# Altium schematic sheet carte_balise_v100.SchDoc: TITLE:
size 410 x 286 mm; Date: Date:; >LAST_DATE_TIME: 11/4/2015 11:37:43 AM; Sheet:: Sheet:; >SHEET: 1; REV:: REV:; Document Number:: Document Number:; >DRAWING_NAME: carte_balise_v100.sch
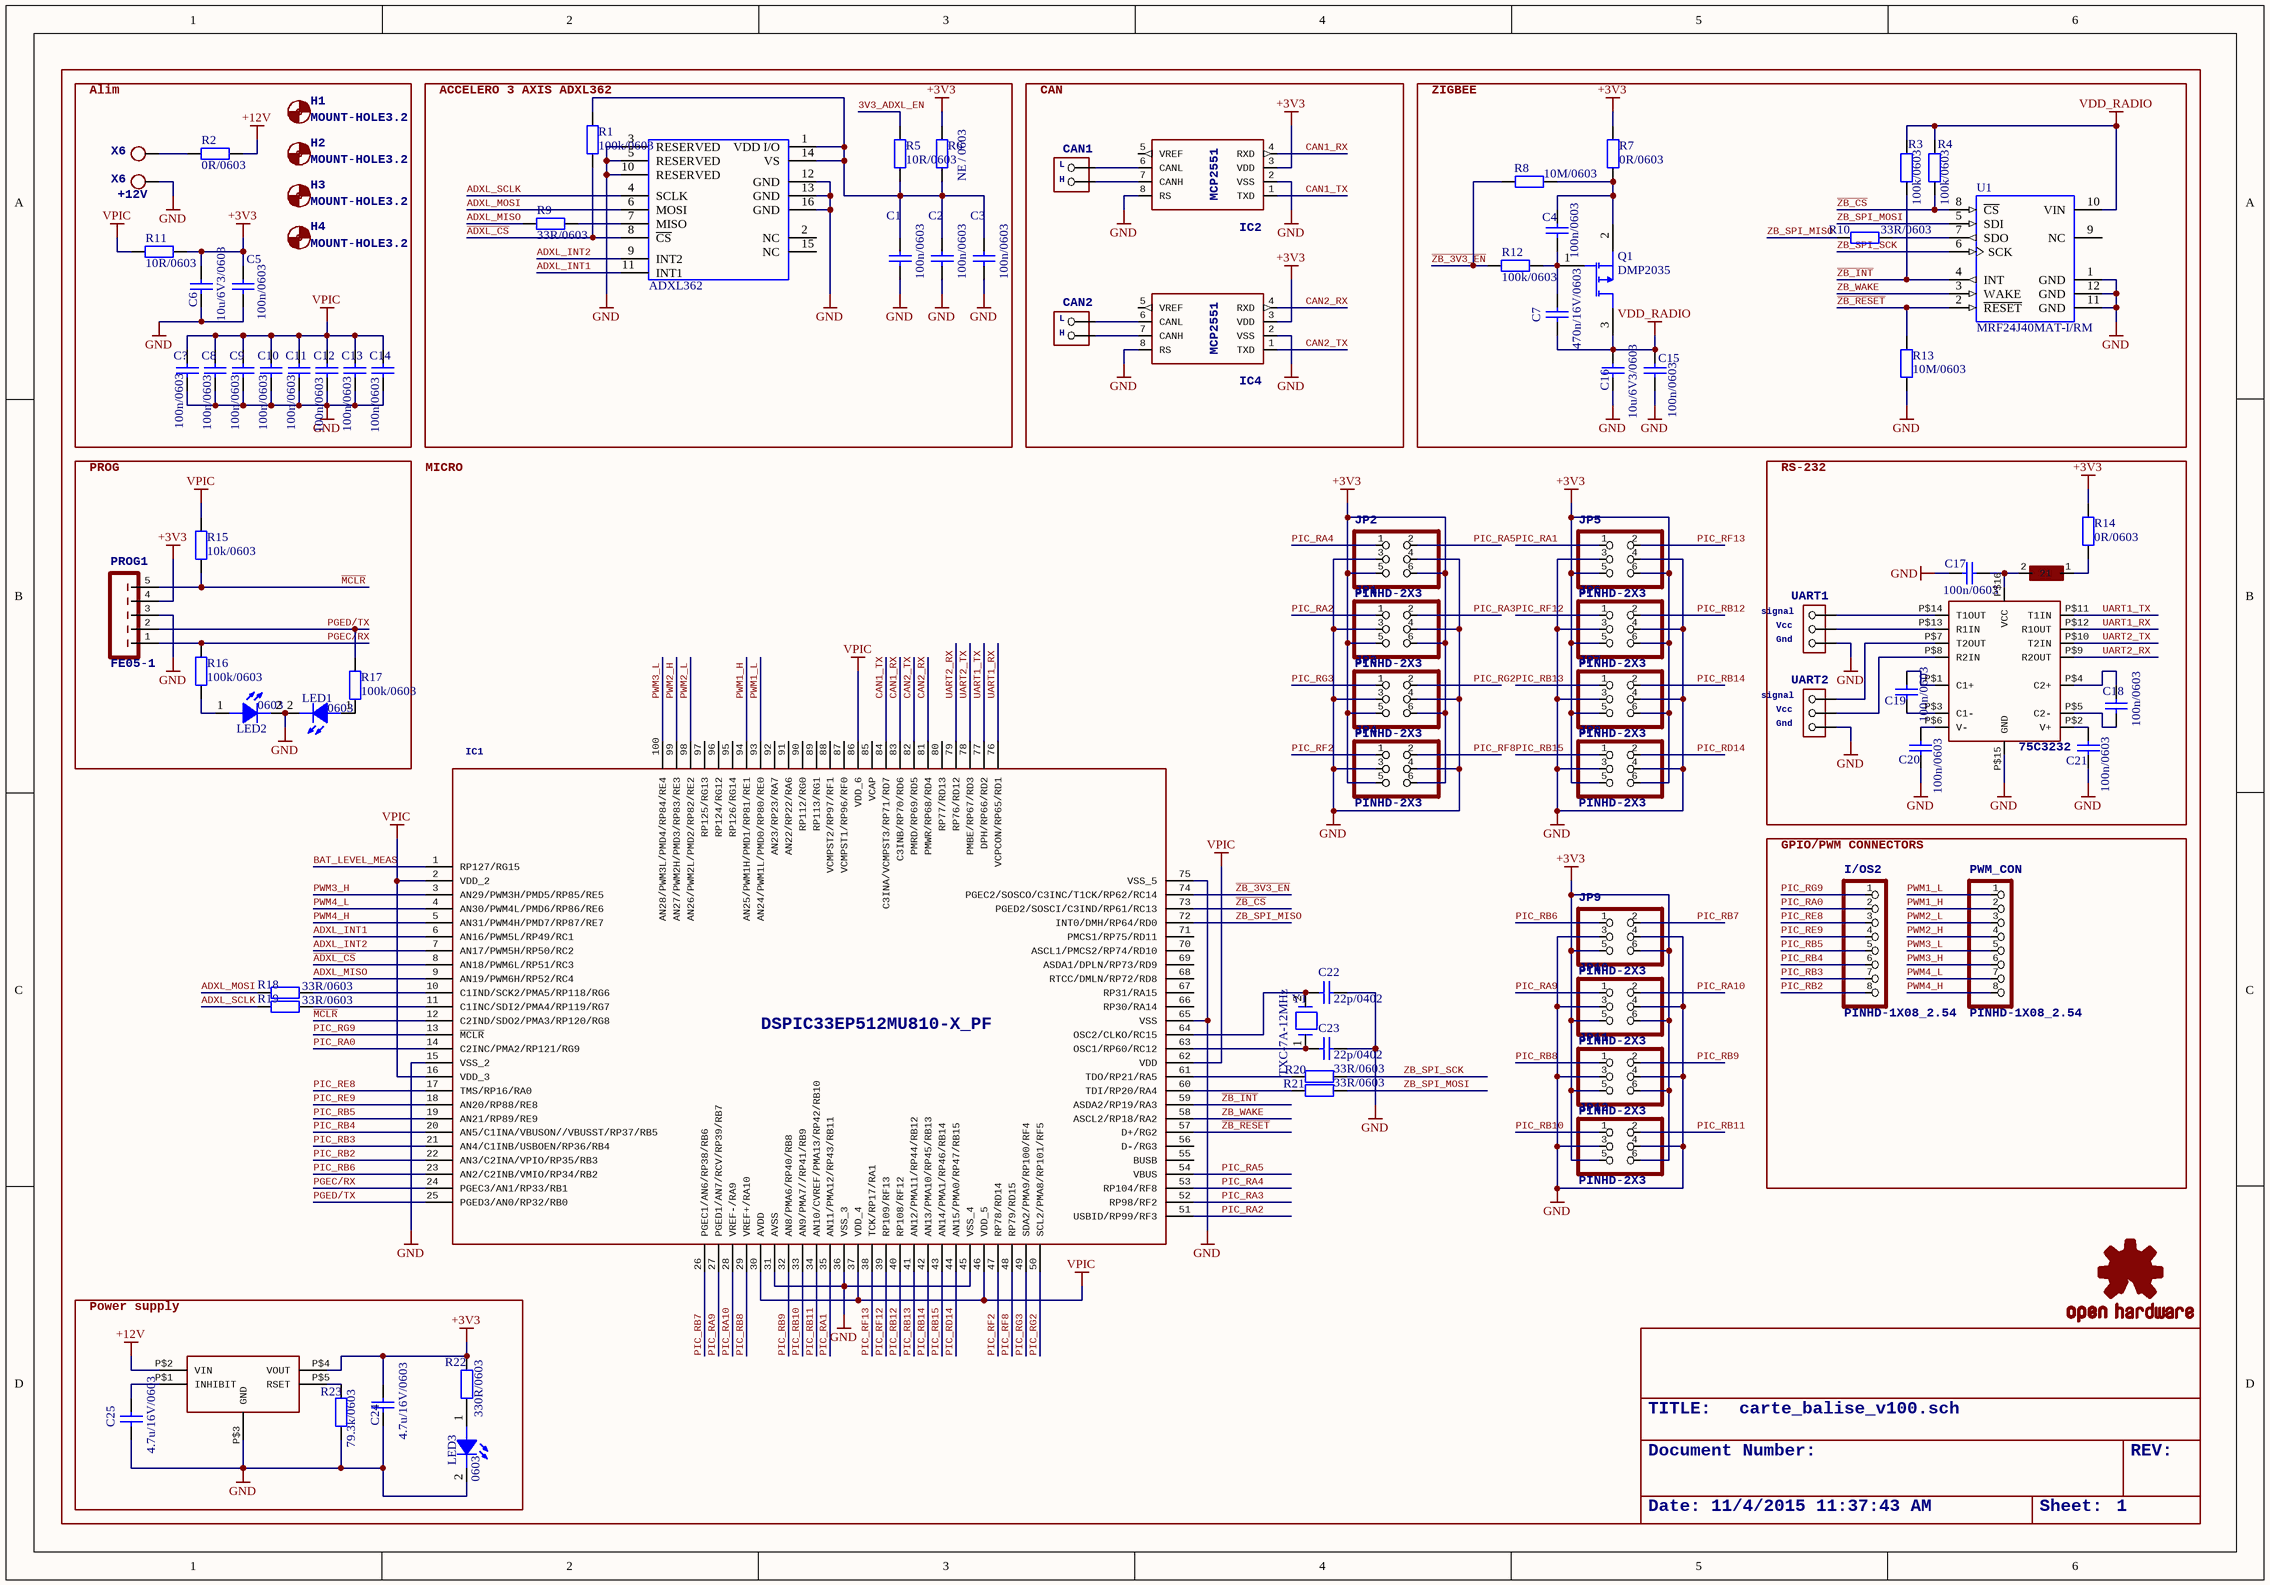
[diagram p0: carte_balise_v100.SchDoc]

## Parts
C1  100n/0603  [SMD_CA_0603_HD]
C2  100n/0603  [SMD_CA_0603_HD]
C3  100n/0603  [SMD_CA_0603_HD]
C4  100n/0603  [SMD_CA_0603_HD]
C5  100n/0603  [SMD_CA_0603_HD]
C6  10u/6V3/0603  [SMD_CA_0603_HD]
C7  470n/16V/0603  [SMD_CA_0603_HD]
C8  100n/0603  [SMD_CA_0603_HD]
C9  100n/0603  [SMD_CA_0603_HD]
C10  100n/0603  [SMD_CA_0603_HD]
C11  100n/0603  [SMD_CA_0603_HD]
C12  100n/0603  [SMD_CA_0603_HD]
C13  100n/0603  [SMD_CA_0603_HD]
C14  100n/0603  [SMD_CA_0603_HD]
C15  100n/0603  [SMD_CA_0603_HD]
C16  10u/6V3/0603  [SMD_CA_0603_HD]
C17  100n/0603  [SMD_CA_0603_HD]
C18  100n/0603  [SMD_CA_0603_HD]
C19  100n/0603  [SMD_CA_0603_HD]
C20  100n/0603  [SMD_CA_0603_HD]
C21  100n/0603  [SMD_CA_0603_HD]
C22  22p/0402  [SMD_CA_0402_HD]
C23  22p/0402  [SMD_CA_0402_HD]
C24  4.7u/16V/0603  [SMD_CA_0603_HD]
C25  4.7u/16V/0603  [SMD_CA_0603_HD]
C?  100n/0603  [SMD_CA_0603_HD]
CAN1  >NAME: CAN1  [CONNECT_CAN]  (hidden comment: CONNECT_CAN)
CAN2  >NAME: CAN2  [CONNECT_CAN]  (hidden comment: CONNECT_CAN)
H1  >NAME: H1  [3,2]  (hidden comment: MOUNT-HOLE3.2)
H2  >NAME: H2  [3,2]  (hidden comment: MOUNT-HOLE3.2)
H3  >NAME: H3  [3,2]  (hidden comment: MOUNT-HOLE3.2)
H4  >NAME: H4  [3,2]  (hidden comment: MOUNT-HOLE3.2)
I/OS2  >NAME: I/OS2  [1X08]  (hidden comment: PINHD-1X08_2.54)
IC1  >NAME: IC1  [TQFP100_14X14MC]  (hidden comment: DSPIC33EP512MU810-X_PF)
IC2  >NAME: IC2  [SO08]  (hidden comment: MCP2551/SN)
IC4  >NAME: IC4  [SO08]  (hidden comment: MCP2551/SN)
JP1  >NAME: JP1  [2X03]  (hidden comment: PINHD-2X3)
JP2  >NAME: JP2  [2X03]  (hidden comment: PINHD-2X3)
JP3  >NAME: JP3  [2X03]  (hidden comment: PINHD-2X3)
JP4  >NAME: JP4  [2X03]  (hidden comment: PINHD-2X3)
JP5  >NAME: JP5  [2X03]  (hidden comment: PINHD-2X3)
JP6  >NAME: JP6  [2X03]  (hidden comment: PINHD-2X3)
JP7  >NAME: JP7  [2X03]  (hidden comment: PINHD-2X3)
JP8  >NAME: JP8  [2X03]  (hidden comment: PINHD-2X3)
JP9  >NAME: JP9  [2X03]  (hidden comment: PINHD-2X3)
JP10  >NAME: JP10  [2X03]  (hidden comment: PINHD-2X3)
JP11  >NAME: JP11  [2X03]  (hidden comment: PINHD-2X3)
JP12  >NAME: JP12  [2X03]  (hidden comment: PINHD-2X3)
LED1  0603  [SDM_LED_0603]
LED2  0603  [SDM_LED_0603]
LED3  0603  [SDM_LED_0603]
PROG1  >NAME: PROG1  [FE05-1]  (hidden comment: FE05-1)
PWM_CON  >NAME: PWM_CON  [1X08]  (hidden comment: PINHD-1X08_2.54)
Q1  DMP2035  [SMD_TR_SOT23-3]
R1  100k/0603  [SMD_RE_0603_HD]
R2  0R/0603  [SMD_RE_0603_HD]
R3  100k/0603  [SMD_RE_0603_HD]
R4  100k/0603  [SMD_RE_0603_HD]
R5  10R/0603  [SMD_RE_0603_HD]
R6  NE / 0603  [SMD_RE_0603_HD]
R7  0R/0603  [SMD_RE_0603_HD]
R8  10M/0603  [SMD_RE_0603_HD]
R9  33R/0603  [SMD_RE_0603_HD]
R10  33R/0603  [SMD_RE_0603_HD]
R11  10R/0603  [SMD_RE_0603_HD]
R12  100k/0603  [SMD_RE_0603_HD]
R13  10M/0603  [SMD_RE_0603_HD]
R14  0R/0603  [SMD_RE_0603_HD]
R15  10k/0603  [SMD_RE_0603_HD]
R16  100k/0603  [SMD_RE_0603_HD]
R17  100k/0603  [SMD_RE_0603_HD]
R18  33R/0603  [SMD_RE_0603_HD]
R19  33R/0603  [SMD_RE_0603_HD]
R20  33R/0603  [SMD_RE_0603_HD]
R21  33R/0603  [SMD_RE_0603_HD]
R22  330R/0603  [SMD_RE_0603_HD]
R23  79.3k/0603  [SMD_RE_0603_HD]
U1  MRF24J40MAT-I/RM  [SMD_MRF24J40MA -tight]
U2  ADXL362  [SMD_IC_LGA_16]
U$1  OSHW-LOGOS  [OSHW-LOGO-S]  (value not drawn)
U$2  SN75C3232_PW  [PW16]  (value not drawn)
U$3  L_603  [0603]  (value not drawn)
U$27  PTR08100W  [PTR08100W]  (value not drawn)
UART1  >NAME: UART1  [CON_2.54_3]  (hidden comment: CONNECT_3PINS_CMS)
UART2  >NAME: UART2  [CON_2.54_3]  (hidden comment: CONNECT_3PINS_CMS)
X6  >NAME: X6  [W237-102]  (hidden comment: +12V)  (parts A,B of 2)
Y1  TXC-7A-12MHz  [SMD_OSC_5X3.2_2PINS]

## Blocks framed on the sheet
Alim: C5 C6 C8-C14 C? H1-H4 R2 R11 X6
ACCELERO 3 AXIS ADXL362: C1-C3 R1 R5 R6 R9 U2
CAN: CAN1 CAN2 IC2 IC4
ZIGBEE: C4 C7 C15 C16 Q1 R3 R4 R7 R8 R10 R12 R13 U1
PROG: LED1 LED2 PROG1 R15-R17
RS-232: C17-C21 R14 U$2 U$3 UART1 UART2
GPIO/PWM CONNECTORS: I/OS2 PWM_CON
Power supply: C24 C25 LED3 R22 R23 U$27

## Nets
+3V3: C5.1 C6.2 C24.2 IC2.3(VDD) IC4.3(VDD) JP1.5 JP1.6 JP2.5 JP2.6 JP3.5 JP3.6 JP4.5 JP4.6 JP5.5 JP5.6 JP6.5 JP6.6 JP7.5 JP7.6 JP8.5 JP8.6 JP9.5 JP9.6 JP10.5 JP10.6 JP11.5 JP11.6 JP12.5 JP12.6 PROG1.4 R6.2 R7.2 R11.2 R14.2 R22.2 U$27.P$4(VOUT)
+12V: R2.2 U$27.P$2(VIN)
GND: C1.2 C2.2 C3.1 C5.2 C6.1 C8.1 C9.1 C10.1 C11.1 C12.1 C13.1 C14.1 C15.2 C16.1 C17.1 C20.1 C21.1 C22.2 C23.2 C24.1 C25.1 C?.1 IC1.15(VSS_2) IC1.31(AVSS) IC1.36(VSS_3) IC1.45(VSS_4) IC1.65(VSS) IC1.75(VSS_5) IC2.2(VSS) IC2.8(RS) IC4.2(VSS) IC4.8(RS) JP1.3 JP1.4 JP2.3 JP2.4 JP3.3 JP3.4 JP4.3 JP4.4 JP5.3 JP5.4 JP6.3 JP6.4 JP7.3 JP7.4 JP8.3 JP8.4 JP9.3 JP9.4 JP10.3 JP10.4 JP11.3 JP11.4 JP12.3 JP12.4 LED1.2(CATHODE) LED2.2(CATHODE) LED3.2(CATHODE) PROG1.3 R13.1 R23.1 U1.1(GND) U1.11(GND) U1.12(GND) U2.3(RESERVED) U2.5(RESERVED) U2.10(RESERVED) U2.12(GND) U2.13(GND) U2.16(GND) U$2.P$15(GND) U$27.P$3(GND) UART1.P$1(_GND) UART2.P$1(_GND) X6.2(KL)
VDD_RADIO: C7.1 C15.1 C16.2 Q1.3(D) R3.2 R4.2 U1.10(VIN)
VPIC: C8.2 C9.2 C10.2 C11.2 C12.2 C13.2 C14.2 C?.2 IC1.2(VDD_2) IC1.16(VDD_3) IC1.30(AVDD) IC1.37(VDD_4) IC1.46(VDD_5) IC1.62(VDD) IC1.86(VDD_6) R11.1 R15.2
3V3_ADXL_EN: R5.2
~{ADXL_CS}: IC1.8(AN18/PWM6L/RP51/RC3) R1.1 U2.8(~{CS})
ADXL_INT1: IC1.6(AN16/PWM5L/RP49/RC1) U2.11(INT1)
ADXL_INT2: IC1.7(AN17/PWM5H/RP50/RC2) U2.9(INT2)
ADXL_MISO: IC1.9(AN19/PWM6H/RP52/RC4) R9.1
ADXL_MOSI: R18.1 U2.6(MOSI)
ADXL_SCLK: R19.1 U2.4(SCLK)
BAT_LEVEL_MEAS: IC1.1(RP127/RG15)
CAN1_RX: IC1.83(C3INB/RP70/RD6) IC2.4(RXD)
CAN1_TX: IC1.84(C3INA/VCMPST3/RP71/RD7) IC2.1(TXD)
CAN2_RX: IC1.81(PMWR/RP68/RD4) IC4.4(RXD)
CAN2_TX: IC1.82(PMRD/RP69/RD5) IC4.1(TXD)
~{MCLR}: IC1.12(C2IND/SDO2/PMA3/RP120/RG8) PROG1.5 R15.1
PGEC/RX: IC1.24(PGEC3/AN1/RP33/RB1) PROG1.1 R16.2
PGED/TX: IC1.25(PGED3/AN0/RP32/RB0) PROG1.2 R17.2
PIC_RA0: I/OS2.2 IC1.14(C2INC/PMA2/RP121/RG9)
PIC_RA1: IC1.35(AN11/PMA12/RP43/RB11) JP5.1
PIC_RA2: IC1.51(USBID/RP99/RF3) JP1.1
PIC_RA3: IC1.52(RP98/RF2) JP1.2
PIC_RA4: IC1.53(RP104/RF8) JP2.1
PIC_RA5: IC1.54(VBUS) JP2.2
PIC_RA9: IC1.27(PGED1/AN7/RCV/RP39/RB7) JP10.1
PIC_RA10: IC1.28(VREF-/RA9) JP10.2
PIC_RB2: I/OS2.8 IC1.22(AN3/C2INA/VPIO/RP35/RB3)
PIC_RB3: I/OS2.7 IC1.21(AN4/C1INB/USBOEN/RP36/RB4)
PIC_RB4: I/OS2.6 IC1.20(AN5/C1INA/VBUSON//VBUSST/RP37/RB5)
PIC_RB5: I/OS2.5 IC1.19(AN21/RP89/RE9)
PIC_RB6: IC1.23(AN2/C2INB/VMIO/RP34/RB2) JP9.1
PIC_RB7: IC1.26(PGEC1/AN6/RP38/RB6) JP9.2
PIC_RB8: IC1.29(VREF+/RA10) JP11.1
PIC_RB9: IC1.32(AN8/PMA6/RP40/RB8) JP11.2
PIC_RB10: IC1.33(AN9/PMA7//RP41/RB9) JP12.1
PIC_RB11: IC1.34(AN10/CVREF/PMA13/RP42/RB10) JP12.2
PIC_RB12: IC1.40(RP108/RF12) JP6.2
PIC_RB13: IC1.41(AN12/PMA11/RP44/RB12) JP7.1
PIC_RB14: IC1.42(AN13/PMA10/RP45/RB13) JP7.2
PIC_RB15: IC1.43(AN14/PMA1/RP46/RB14) JP8.1
PIC_RD14: IC1.44(AN15/PMA0/RP47/RB15) JP8.2
PIC_RE8: I/OS2.3 IC1.17(TMS/RP16/RA0)
PIC_RE9: I/OS2.4 IC1.18(AN20/RP88/RE8)
PIC_RF2: IC1.47(RP78/RD14) JP4.1
PIC_RF8: IC1.48(RP79/RD15) JP4.2
PIC_RF12: IC1.39(RP109/RF13) JP6.1
PIC_RF13: IC1.38(TCK/RP17/RA1) JP5.2
PIC_RG2: IC1.50(SCL2/PMA8/RP101/RF5) JP3.2
PIC_RG3: IC1.49(SDA2/PMA9/RP100/RF4) JP3.1
PIC_RG9: I/OS2.1 IC1.13(~{MCLR})
PWM1_H: IC1.94(AN25/PWM1H/PMD1/RP81/RE1) PWM_CON.2
PWM1_L: IC1.93(AN24/PWM1L/PMD0/RP80/RE0) PWM_CON.1
PWM2_H: IC1.99(AN27/PWM2H/PMD3/RP83/RE3) PWM_CON.4
PWM2_L: IC1.98(AN26/PWM2L/PMD2/RP82/RE2) PWM_CON.3
PWM3_H: IC1.3(AN29/PWM3H/PMD5/RP85/RE5) PWM_CON.6
PWM3_L: IC1.100(AN28/PWM3L/PMD4/RP84/RE4) PWM_CON.5
PWM4_H: IC1.5(AN31/PWM4H/PMD7/RP87/RE7) PWM_CON.8
PWM4_L: IC1.4(AN30/PWM4L/PMD6/RP86/RE6) PWM_CON.7
UART1_RX: IC1.76(VCPCON/RP65/RD1) U$2.P$12(R1OUT)
UART1_TX: IC1.77(DPH/RP66/RD2) U$2.P$11(T1IN)
UART2_RX: IC1.79(RP76/RD12) U$2.P$9(R2OUT)
UART2_TX: IC1.78(PMBE/RP67/RD3) U$2.P$10(T2IN)
~{ZB_3V3_EN}: IC1.74(PGEC2/SOSCO/C3INC/T1CK/RP62/RC14) R8.2 R12.2
~{ZB_CS}: IC1.73(PGED2/SOSCI/C3IND/RP61/RC13) R4.1 U1.8(~{CS})
~{ZB_INT}: IC1.59(ASDA2/RP19/RA3) R3.1 U1.4(INT)
~{ZB_RESET}: IC1.57(D+/RG2) R13.2 U1.2(~{RESET})
ZB_SPI_MISO: IC1.72(INT0/DMH/RP64/RD0) R10.1
ZB_SPI_MOSI: R21.2 U1.5(SDI)
ZB_SPI_SCK: R20.2 U1.6(SCK)
ZB_WAKE: IC1.58(ASCL2/RP18/RA2) U1.3(WAKE)
NetC1_1: C1.1 C2.1 C3.2 R1.2 R5.1 R6.1 U2.1(VDD_I/O) U2.14(VS)
NetC4_1: C4.1 Q1.2(S) R7.1 R8.1
NetC4_2: C4.2 C7.2 Q1.1(G) R12.1
NetC17_2: C17.2 U$2.P$16(VCC) U$3.2
NetC18_1: C18.1 U$2.P$5(C2-)
NetC18_2: C18.2 U$2.P$4(C2+)
NetC19_1: C19.1 U$2.P$3(C1-)
NetC19_2: C19.2 U$2.P$1(C1+)
NetC20_2: C20.2 U$2.P$6(V-)
NetC21_2: C21.2 U$2.P$2(V+)
NetC22_1: C22.1 IC1.64(OSC2/CLKO/RC15) Y1.2
NetC23_1: C23.1 IC1.63(OSC1/RP60/RC12) Y1.1
NetC25_2: C25.2 U$27.P$1(INHIBIT)
NetCAN1__H: CAN1._H IC2.7(CANH)
NetCAN1__L: CAN1._L IC2.6(CANL)
NetCAN2__H: CAN2._H IC4.7(CANH)
NetCAN2__L: CAN2._L IC4.6(CANL)
NetIC1_10: IC1.10(C1IND/SCK2/PMA5/RP118/RG6) R18.2
NetIC1_11: IC1.11(C1INC/SDI2/PMA4/RP119/RG7) R19.2
NetIC1_60: IC1.60(TDI/RP20/RA4) R21.1
NetIC1_61: IC1.61(TDO/RP21/RA5) R20.1
NetLED1_1: LED1.1(ANODE) R17.1
NetLED2_1: LED2.1(ANODE) R16.1
NetLED3_1: LED3.1(ANODE) R22.1
NetR2_1: R2.1 X6.1(KL)
NetR9_2: R9.2 U2.7(MISO)
NetR10_2: R10.2 U1.7(SDO)
NetR14_1: R14.1 U$3.1
NetR23_2: R23.2 U$27.P$5(RSET)
NetU$2_P$7: U$2.P$7(T2OUT) UART2.P$3(_SIGN)
NetU$2_P$8: U$2.P$8(R2IN) UART2.P$2(_VCC)
NetU$2_P$13: U$2.P$13(R1IN) UART1.P$2(_VCC)
NetU$2_P$14: U$2.P$14(T1OUT) UART1.P$3(_SIGN)

Not connected (* = marked no-connect by the designer): IC1 55(BUSB) 56(D-/RG3) 66(RP30/RA14) 67(RP31/RA15) 68(RTCC/DMLN/RP72/RD8) 69(ASDA1/DPLN/RP73/RD9) 70(ASCL1/PMCS2/RP74/RD10) 71(PMCS1/RP75/RD11) 80(RP77/RD13) 85(VCAP) 87(VCMPST1/RP96/RF0) 88(VCMPST2/RP97/RF1) 89(RP113/RG1) 90(RP112/RG0) 91(AN22/RP22/RA6) 92(AN23/RP23/RA7) 95(RP126/RG14) 96(RP124/RG12) 97(RP125/RG13); IC2 5(VREF); IC4 5(VREF); U1 9(NC); U2 2(NC) 15(NC)

## Notes on the sheet
- MICRO

## Library data of the parts
C1-C5 C8-C15 C17-C21 C? = ?? SMD 0603: Capacitor - 0603 SMD; PackageReference: 0603; Manufacturer: *; Value: 100n/0603; Publisher: SWAD
C6 C16 = 10uF/6V3 X5R SMD 0603: Capacitor - 10uF 6.3V 20% X5R (ESR<1R) 0603 SMD; Manufacturer: Murata; PartNumber: GRM188R60J106ME47J; Value_Order: 10u; Note: Footprint corresponds to dimensions for bulk cassette packaging. This case size has tightened tolerances.; ID_DEVIALET: 1CSCAxxxx; ID_SEPROLEC: 12314726; PackageReference: 0603; Value: 10u/6V3/0603
C7 = 470n/16V X7R SMD 0603: Capacitor - 470nF 16V X7R 10% 0603 SMD; Manufacturer: Murata; PartNumber: GRM188R71C474KA88D; Value_Order: 0.47u; ID_DEVIALET: 1CSCAxxxx; PackageReference: 0603; ID_SEPROLEC: ?; Value: 470n/16V/0603
C22 C23 = 24p/50V NPO SMD 0402: Capacitor - 24p 50V 5% NPO 0402 SMD; Manufacturer: MURATA; PartNumber: C0402C240J5GACTU; Value_Order: 0.000024u; PackageReference: 0402; LatestRevisionDate: 7-may-2010; ID_SEPROLEC: ?; ID_DEVIALET: ?; Value: 22p/0402
C24 C25 = 4.7uF/16V X5R SMD 0603: Capacitor - 4.7uF 16V 20% X5R (ESR<1R) 0603 SMD; Manufacturer: Murata; PartNumber: GRM188R61C475ME11J; Value_Order: 4.7u; ID_DEVIALET: 1CSCAxxxx; ID_SEPROLEC: 12310438; PackageReference: 0603; Value: 4.7u/16V/0603
CAN1 CAN2 = CONNECT_CAN: <b>Connecteur CAN</b> (club robot)<p> / Utilisé pour relier le cable de liaison CAN. Mais peut également être utilisé comme un connecteur à 2 broches (le pas est standard) pour des capteurs par exemple.; H: H; L: L
H1-H4 = MOUNT-HOLE3.2: <b>MOUNTING HOLE</b> with drill center marker; >VALUE: MOUNT-HOLE3.2
I/OS2 PWM_CON = PINHD-1X08_2.54: <b>PIN HEADER</b>; >VALUE: PINHD-1X08_2.54
IC1 = DSPIC33EP512MU810-X_PF: dsPIC33EP512MU810-X_PF TQFP100 14x14; >VALUE: DSPIC33EP512MU810-X_PF
IC2 IC4 = MCP2551/SN: <b>High-Speed CAN Transceiver</b>; MCP2551: MCP2551
JP1-JP12 = PINHD-2X3: <b>PIN HEADER</b>; >VALUE: PINHD-2X3
LED1-LED3 = NE_LED 0603: Not Equipe; ID_DEVIALET: 1CSDIxxxx; PackageReference: 0603; Manufacturer: -; PartNumber: -; ID_SEPROLEC: -; Value: 0603
PROG1 = FE05-1: <b>FEMALE HEADER</b>; >VALUE: FE05-1
Q1 = DMP2035U_P_MOS: P-CHANNEL ENHANCEMENT MODE MOSFET; Manufacturer: Diodes Inc.; ID_SEPROLEC: 12320998; PartNumber: DMP2035U; PackageReference: SOT23; ID_DEVIALET: ?; Value: DMP2035
R1 R3-R5 R8-R13 R15-R23 = ?? SMD R 0603: Resistor - 0603 ??? SMD; ID_DEVIALET: 1CSRExxxx; PackageReference: 0603; Manufacturer: *; PartNumber: *; Published: 7-6-2010; Publisher: DEVIALET
  R1 R3 R4 R12 R16 R17: Value: 100k/0603
  R5 R11: Value: 10R/0603
  R8 R13: Value: 10M/0603
  R9 R10 R18-R21: Value: 33R/0603
  R15: Value: 10k/0603
  R22: Value: 330R/0603
  R23: Value: 79.3k/0603
R2 R6 R7 R14 = 0R ERJ-3GEY0R00V SMD R 0603: Resistor - 0R 1%  0603 SMD; Manufacturer: Panasonic; ID_SEPROLEC: 12306396; PackageReference: 0603; Value_Order: 0R; ID_DEVIALET: ?; PartNumber: ERJ-3GEY0R00V
  R2 R7 R14: Value: 0R/0603
  R6: Value: NE / 0603
U1 = MRF24J40MAT-I: IC ZIGBEE 2.4 GHz IEEE Std. 802.15.4, RF Transceiver 12- Pin Module SMD; Manufacturer: Microchip; ID_SEPROLEC: 12314483; DatasheetVersion: revB, Nov-2008; PackageVersion: Nov-2008; PackageReference: MRF24J40MA; PackageDescription: Transceiver Module; SM; 12 Leads; Body 1.1 x 0.7 x 0.067" (LxWxH), 0.1" Pitch; Mounting Technology: Surface Mount; PartNumber: MRF24J40MAT-I/RM; ComponentLink1Description: Manufacturer URL; ComponentLink1URL: http://www.microchip.com/; ComponentLink2Description: Datasheet; ComponentLink2URL: http://ww1.microchip.com/downloads/en/DeviceDoc/70329b.pdf; ComponentLink3Description: Package Specification; ComponentLink3URL: http://www.microchip.com/stellent/groups/techpub_sg/documents/packagingspec/en012702.pdf; ID_DEVIALET: ?; Value: MRF24J40MAT-I/RM
U2 = ADXL362: Digital Output MEMS Accelerometer; PartNumber: ADXL362BCCZ-RL; Manufacturer: AD; PackageReference: LGA-16; ID_SEPROLEC: ?; ID_DEVIALET: ?; Value: ADXL362
U$1 = OSHW-LOGOS: <b>Open Source Hardware Logo</b> This logo indicates the piece of hardware it is found on incorporates a OSHW license and/or adheres to the definition of open source hardware found here: http://freedomdefined.org/OSHW
UART1 UART2 = CONNECT_3PINS_CMS: <b>Connecteur à 3 broches</b> (club robot)<p> / Utilisé principalement pour les capteurs ou les servomoteurs.; signal: signal; Vcc: Vcc; Gnd: Gnd
X6 = W237-102: <b>WAGO SCREW CLAMP</b>
Y1 = TXC_7A-12.000MAAJ-T: Crystal Quartz 12MHz, 30ppm, TXC serie-7A, 18pF, 5x3.2mm SMD; ID_DEVIALET: 1CDCLxxxx; Manufacturer: TXC; PackageReference: 5x3.2mm SMD; Publisher: DEVIALET; PartNumber: 7A-12.000MAAJ-T; ID_SEPROLEC: ?; Value: TXC-7A-12MHz
U$2 = SN75C3232_PW: 75C3232: 75C3232